# Altium project design01.PrjPcb
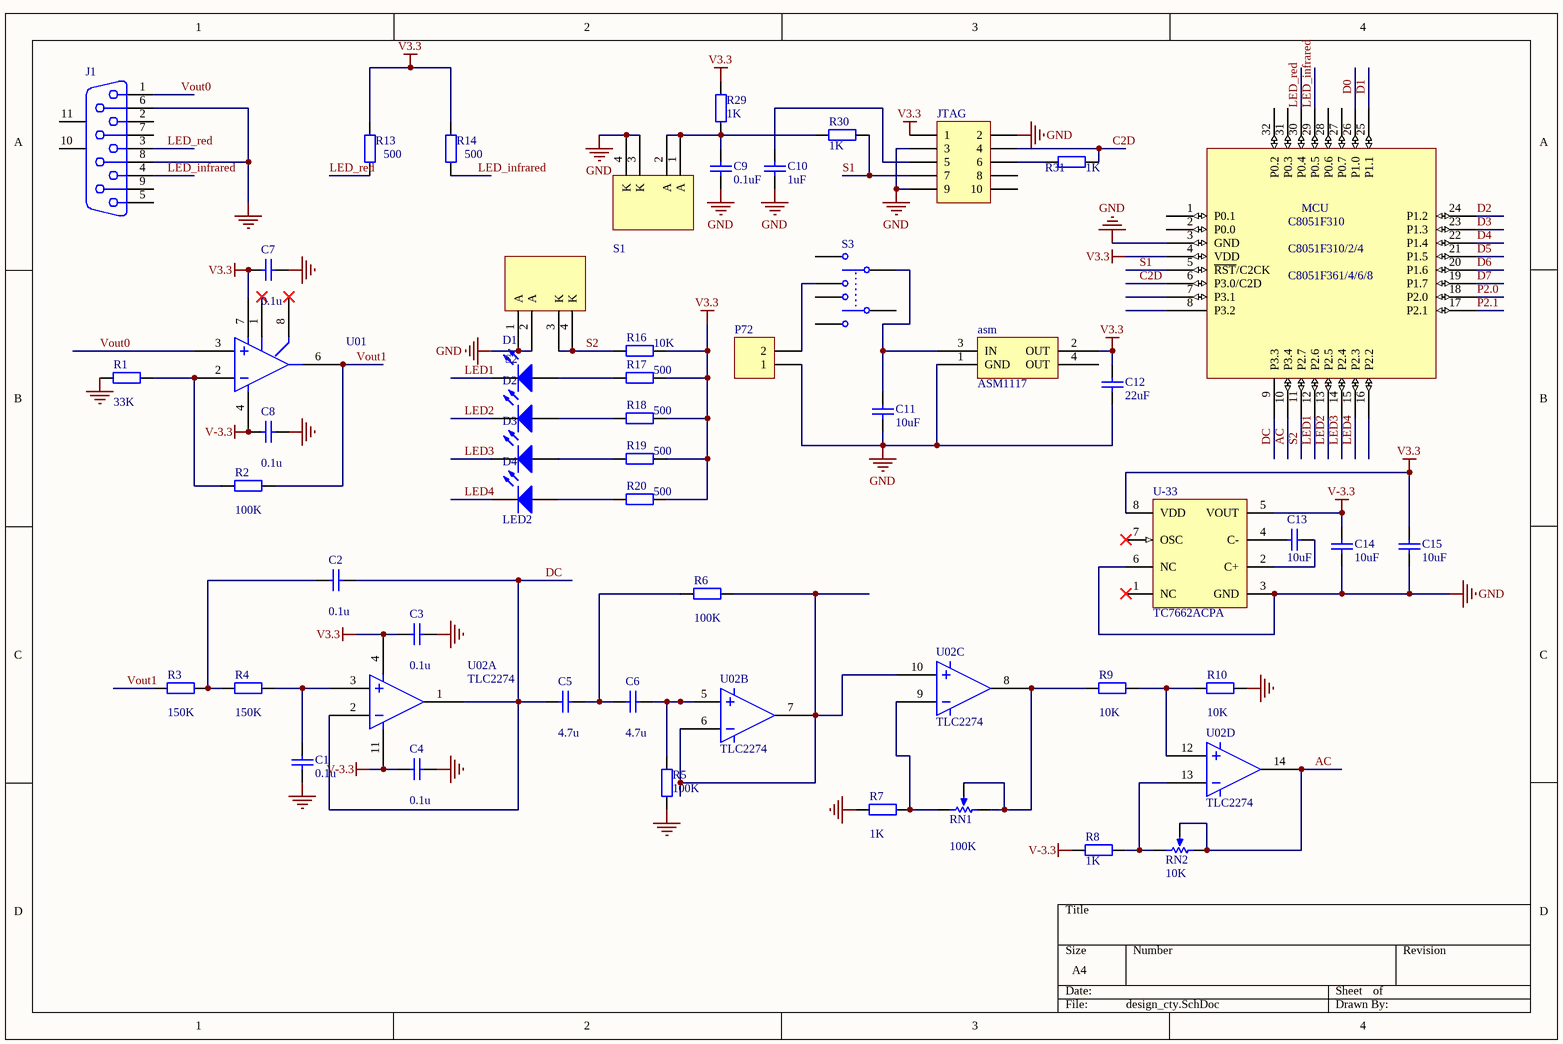
[diagram p0: design_cty.SchDoc]
2 sheets, 55 parts. Net scope: global (net labels, ports and power ports of the same name join across sheets).
Board file: PCB_design01.PcbDoc
Sheets:
  design_cty.SchDoc
  Sheet2.SchDoc

## Sheet design_cty.SchDoc
size A4

### Parts
asm  ASM1117  [SOT-223]
C1  value 0.1u  [0805]  (hidden comment: Cap)
C2  value 0.1u  [0805]  (hidden comment: Cap)
C3  value 0.1u  [0805]  (hidden comment: Cap)
C4  value 0.1u  [0805]  (hidden comment: Cap)
C5  value 4.7u  [0805]  (hidden comment: Cap)
C6  value 4.7u  [0805]  (hidden comment: Cap)
C7  value 0.1u  [0805]  (hidden comment: Cap)
C8  value 0.1u  [0805]  (hidden comment: Cap)
C9  value 0.1uF  [0805]  (hidden comment: Cap)
C10  value 1uF  [0805]  (hidden comment: Cap)
C11  value 10uF  [1206]  (hidden comment: Cap)
C12  value 22uF  [1206]  (hidden comment: Cap)
C13  value 10uF  [1206]  (hidden comment: Cap)
C14  value 10uF  [1206]  (hidden comment: Cap)
C15  value 10uF  [1206]  (hidden comment: Cap)
D1  LED2  [0805]  (value not drawn)
D2  LED2  [0805]  (value not drawn)
D3  LED2  [0805]  (value not drawn)
D4  LED2  [0805]
J1  D Connector 9  [DSUB1.385-2H9]  (value not drawn)
JTAG  Header 5X2  [HDR2X5]  (value not drawn)
MCU  C8051F310  [LQFP-32]
P72  Header 2  [HDR1X2]  (value not drawn)
R1  value 33K  [0805]  (hidden comment: Res2)
R2  value 100K  [0805]  (hidden comment: Res2)
R3  value 150K  [0805]  (hidden comment: Res2)
R4  value 150K  [0805]  (hidden comment: Res2)
R5  value 100K  [0805]  (hidden comment: Res2)
R6  value 100K  [0805]  (hidden comment: Res2)
R7  value 1K  [0805]  (hidden comment: Res2)
R8  value 1K  [0805]  (hidden comment: Res2)
R9  value 10K  [0805]  (hidden comment: Res2)
R10  value 10K  [0805]  (hidden comment: Res2)
R13  value 500  [0805]  (hidden comment: Res2)
R14  value 500  [0805]  (hidden comment: Res2)
R16  value 10K  [0805]  (hidden comment: Res2)
R17  value 500  [0805]  (hidden comment: Res2)
R18  value 500  [0805]  (hidden comment: Res2)
R19  value 500  [0805]  (hidden comment: Res2)
R20  value 500  [0805]  (hidden comment: Res2)
R29  value 1K  [0805]  (hidden comment: Res2)
R30  value 1K  [0805]  (hidden comment: Res2)
R31  value 1K  [0805]  (hidden comment: Res2)
RN1  value 100K  [VR5]  (hidden comment: RPot)
RN2  value 10K  [VR5]  (hidden comment: RPot)
S1  K1  [KEY1]  (value not drawn)
S2  K1  [KEY1]  (value not drawn)
S3  SW-DPDT  [DPDT-6]  (value not drawn)
U01  OP-07  [DIP-8]  (value not drawn)
U02  TLC2274  [SOP-14N]  (parts A,B,C,D of 4)
U-33  TC7662ACPA  [SO-8]

### Nets
GND: asm.1(GND) C1.1 C3.2 C4.2 C7.2 C8.2 C9.1 C10.1 C11.1 C12.1 C14.1 C15.1 J1.6 J1.8 JTAG.2 JTAG.3 JTAG.9 MCU.3(GND) P72.1 R1.1 R5.1 R7.1 R10.2 S1.3(K) S1.4(K) S2.1(A) S2.2(A) U-33.3(GND) U-33.6(NC)
V3.3: asm.2(OUT) C3.1 C7.1 C12.2 C15.2 JTAG.1 MCU.4(VDD) R13.2 R14.2 R16.2 R17.2 R18.2 R19.2 R20.2 R29.2 U01.7 U02.4 U-33.8(VDD)
V-3.3: C4.1 C8.1 C14.2 R8.2 U01.4 U02.11 U-33.5(VOUT)
AC: MCU.10(P3.4) RN2.1(TOP) RN2.3(TAP) U02.14
C2D: JTAG.4 MCU.6(P3.0/C2D) R31.2
D0: MCU.26(P1.0)
D1: MCU.25(P1.1)
D2: MCU.24(P1.2)
D3: MCU.23(P1.3)
D4: MCU.22(P1.4)
D5: MCU.21(P1.5)
D6: MCU.20(P1.6)
D7: MCU.19(P1.7)
DC: C2.2 C5.1 MCU.9(P3.3) U02.1 U02.2
LED1: D1.2(K) MCU.12(P2.6)
LED2: D2.2(K) MCU.13(P2.5)
LED3: D3.2(K) MCU.14(P2.4)
LED4: D4.2(K) MCU.15(P2.3)
LED_infrared: J1.4 MCU.29(P0.5) R14.1
LED_red: J1.3 MCU.30(P0.4) R13.1
P2.0: MCU.18(P2.0)
P2.1: MCU.17(P2.1)
S1: JTAG.7 MCU.5(~{RST}/C2CK) R30.2
S2: MCU.11(P2.7) R16.1 S2.3(K) S2.4(K)
Vout0: J1.1 U01.3
Vout1: R2.2 R3.1 U01.6
Netasm_3: asm.3(IN) C11.2 S3.4
NetC1_2: C1.2 R4.2 U02.3
NetC2_1: C2.1 R3.2 R4.1
NetC5_2: C5.2 C6.1 R6.1
NetC6_2: C6.2 R5.2 U02.5
NetC9_2: C9.2 R29.1 R30.1 S1.1(A) S1.2(A)
NetC10_2: C10.2 JTAG.5
NetC13_1: C13.1 U-33.2(C+)
NetC13_2: C13.2 U-33.4(C-)
NetD1_1: D1.1(A) R17.1
NetD2_1: D2.1(A) R18.1
NetD3_1: D3.1(A) R19.1
NetD4_1: D4.1(A) R20.1
NetJTAG_6: JTAG.6 R31.1
NetP72_2: P72.2 S3.5
NetR1_2: R1.2 R2.1 U01.2
NetR6_2: R6.2 U02.6 U02.7 U02.10
NetR7_2: R7.2 RN1.2(BOT) U02.9
NetR8_1: R8.1 RN2.2(BOT) U02.13
NetR9_1: R9.1 RN1.1(TOP) RN1.3(TAP) U02.8
NetR9_2: R9.2 R10.1 U02.12

Not connected (* = marked no-connect by the designer): asm 4(OUT); J1 2 5 7 9 10(MH1) 11(MH2); JTAG 8 10; MCU 1(P0.1) 2(P0.0) 7(P3.1) 8(P3.2) 16(P2.2) 27(P0.7) 28(P0.6) 31(P0.3) 32(P0.2); S3 1 2 3 6; U01 1* 8*; U-33 1(NC)* 7(OSC)*

### Notes on the sheet
- (in symbol C8051F310/2/4_361/4/6/8) C8051F310/2/4; C8051F361/4/6/8

### Library data of the parts
asm = ASM1117: 3.3V稳压芯片
C1-C15 = Cap: Capacitor; Published: 8-Jun-2000; LatestRevisionDate: 17-Jul-2002; LatestRevisionNote: Re-released for DXP Platform.; PackageReference: RAD-0.3; Publisher: Altium Limited; PackageDescription: Radial Cap, Thru-Hole; 2 Leads; 0.3 in Pin Spacing
D1-D4 = LED2: Typical RED, GREEN, YELLOW, AMBER GaAs LED; Published: 8-Jun-2000; LatestRevisionDate: 17-Jul-2002; LatestRevisionNote: Re-released for DXP Platform.; PackageVersion: Feb-2002; PackageReference: 3.2X1.6X1.1; Publisher: Altium Limited; PackageDescription: SM LED; 2 Flat Leads
J1 = D Connector 9: Receptacle Assembly, 9 Position, Right Angle; PackageDocument: O; Positions: 9; Published: 15-Jun-2001; LatestRevisionDate: 17-Jul-2002; LatestRevisionNote: Re-released for DXP Platform.; DatasheetDocument: 1-Sep-1999; PackageReference: 788750; Publisher: Altium Limited; Orientation: Right Angle; Gender: Receptacle
JTAG = Header 5X2: Header, 5-Pin, Dual row; LatestRevisionDate: 17-Jul-2002; LatestRevisionNote: Re-released for DXP Platform.; Publisher: Altium Limited
MCU = C8051F310/2/4_361/4/6/8
P72 = Header 2: Header, 2-Pin; LatestRevisionDate: 17-Jul-2002; LatestRevisionNote: Re-released for DXP Platform.; Publisher: Altium Limited
R1-R10 R13 R14 R16-R20 R29-R31 = Res2: Resistor; Published: 8-Jun-2000; LatestRevisionDate: 17-Jul-2002; LatestRevisionNote: Re-released for DXP Platform.; PackageReference: AXIAL-0.4; Publisher: Altium Limited; PackageDescription: Axial Device, Thru-Hole; 2 Leads; 0.4 in Pin Spacing
RN1 RN2 = RPot: Potentiometer; Sim Note: Enter the Resistance value and the set point into parameter fields.; Set Position: 0.5; Published: 8-Jun-2000; LatestRevisionDate: 17-Jul-2002; LatestRevisionNote: Re-released for DXP Platform.; PackageReference: VR5; Publisher: Altium Limited; PackageDescription: Variable Resistor, Thru-Hole; 3 Leads
S3 = SW-DPDT: Double-Pole, Double-Throw Switch; Published: 24-Mar-1999; LatestRevisionDate: 17-Jul-2002; LatestRevisionNote: Re-released for DXP Platform.; PackageReference: DPDT-6; Publisher: Altium Limited; PackageDescription: Switch; 6 Leads
U02 = LM324
U-33 = TC7662ACPA: Super Charge Pump DC-to-DC Voltage Converter, 12kHz, 8-Pin PDIP, Commercial Temperature; Published: 29-Jan-2009; DatasheetVersion: revB, Nov-2002; PackageVersion: revAW, Oct-2008; PackageReference: PDIP300-PA8; Publisher: Altium Limited; PackageDescription: 8-Lead Plastic Dual In-Line (PA) - 300 mil Body [PDIP]; Code_JEDEC: MS-001-BA; ComponentLink1Description: Manufacturer Link; ComponentLink1URL: http://www.microchip.com; ComponentLink2Description: Datasheet; ComponentLink2URL: http://ww1.microchip.com/downloads/en/DeviceDoc/21468b.pdf; ComponentLink3Description: Packaging Specification; ComponentLink3URL: http://ww1.microchip.com/downloads/en/PackagingSpec/00049AW.pdf

## Sheet Sheet2.SchDoc
size A4
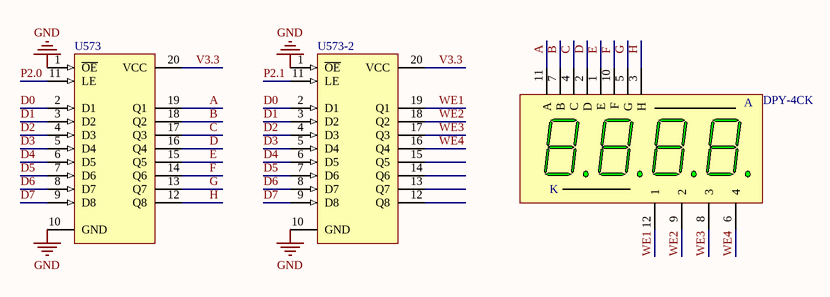
[diagram p1: Sheet2.SchDoc]

### Parts
DPY-4CK  DPY-4CK  [DYP-4BIT]  (value not drawn)
U573  SN74HC573N  [N020D]  (value not drawn)
U573-2  SN74HC573N  [N020D]  (value not drawn)

### Nets
GND: U573.1(~{OE}) U573.10(GND) U573-2.1(~{OE}) U573-2.10(GND)
V3.3: U573.20(VCC) U573-2.20(VCC)
A: DPY-4CK.11(A) U573.19(Q1)
B: DPY-4CK.7(B) U573.18(Q2)
C: DPY-4CK.4(C) U573.17(Q3)
D: DPY-4CK.2(D) U573.16(Q4)
D0: U573.2(D1) U573-2.2(D1)
D1: U573.3(D2) U573-2.3(D2)
D2: U573.4(D3) U573-2.4(D3)
D3: U573.5(D4) U573-2.5(D4)
D4: U573.6(D5) U573-2.6(D5)
D5: U573.7(D6) U573-2.7(D6)
D6: U573.8(D7) U573-2.8(D7)
D7: U573.9(D8) U573-2.9(D8)
E: DPY-4CK.1(E) U573.15(Q5)
F: DPY-4CK.10(F) U573.14(Q6)
G: DPY-4CK.5(G) U573.13(Q7)
H: DPY-4CK.3(H) U573.12(Q8)
P2.0: U573.11(LE)
P2.1: U573-2.11(LE)
WE1: DPY-4CK.12(1) U573-2.19(Q1)
WE2: DPY-4CK.9(2) U573-2.18(Q2)
WE3: DPY-4CK.8(3) U573-2.17(Q3)
WE4: DPY-4CK.6(4) U573-2.16(Q4)

Not connected (* = marked no-connect by the designer): U573-2 12(Q8) 13(Q7) 14(Q6) 15(Q5)

### Notes on the sheet
- (in symbol DPY-4CK) K

### Library data of the parts
DPY-4CK = DPY-4CK: 共阴4位数码管
U573 U573-2 = SN74HC573N: Octal D-Type Transparent Latch with 3-State Outputs; Published: 8-Jun-2000; LatestRevisionDate: 04-Mar-2005; LatestRevisionNote: Stylized 3D Model Added.; DatasheetVersion: Jun-1989; PackageVersion: Oct-1995; PackageReference: N020D; Publisher: Altium Limited; PackageDescription: DIP; 20 Leads; Row Spacing 7.62 mm; Pitch 2.54 mm; ComponentLink1Description: Manufacturer Link; ComponentLink1URL: http://www.ti.com/

## Nets that join several sheets
GND: design_cty (29 pins), Sheet2 (U573.1 U573.10 U573-2.1 U573-2.10)
V3.3: design_cty (18 pins), Sheet2 (U573.20 U573-2.20)
D0: design_cty (MCU.26), Sheet2 (U573.2 U573-2.2)
D1: design_cty (MCU.25), Sheet2 (U573.3 U573-2.3)
D2: design_cty (MCU.24), Sheet2 (U573.4 U573-2.4)
D3: design_cty (MCU.23), Sheet2 (U573.5 U573-2.5)
D4: design_cty (MCU.22), Sheet2 (U573.6 U573-2.6)
D5: design_cty (MCU.21), Sheet2 (U573.7 U573-2.7)
D6: design_cty (MCU.20), Sheet2 (U573.8 U573-2.8)
D7: design_cty (MCU.19), Sheet2 (U573.9 U573-2.9)
P2.0: design_cty (MCU.18), Sheet2 (U573.11)
P2.1: design_cty (MCU.17), Sheet2 (U573-2.11)